# Altium project RTLS_Anchor.PrjPcb
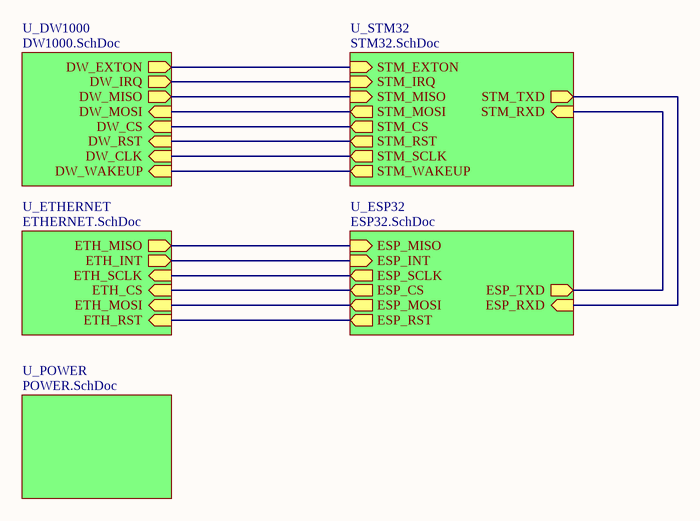
[diagram p0: ANCHOR.SchDoc]
6 sheets, 126 parts. Net scope: hierarchical (ports join the sheet entries above them; power ports are global).
Board files: Anchor_PCB.PcbDoc, AnchorV2.PcbDoc
Sheets:
  ANCHOR.SchDoc
    U_ETHERNET = ETHERNET.SchDoc
    U_POWER = POWER.SchDoc
    U_DW1000 = DW1000.SchDoc
    U_ESP32 = ESP32.SchDoc
    U_STM32 = STM32.SchDoc

## Sheet ANCHOR.SchDoc
size A; SheetNumber: 1; SheetTotal: 6

### Sub-sheets
U_DW1000 = DW1000.SchDoc: DW_MOSI (in), DW_CS (in), DW_EXTON (out), DW_IRQ (out), DW_RST (in), DW_CLK (in), DW_MISO (out), DW_WAKEUP (in)
U_ESP32 = ESP32.SchDoc: ESP_RXD (in), ESP_TXD (out), ESP_MISO (in), ESP_MOSI (out), ESP_SCLK (out), ESP_CS (out), ESP_RST (out), ESP_INT (in)
U_ETHERNET = ETHERNET.SchDoc: ETH_RST (in), ETH_INT (out), ETH_MOSI (in), ETH_MISO (out), ETH_SCLK (in), ETH_CS (in)
U_POWER = POWER.SchDoc: no entries
U_STM32 = STM32.SchDoc: STM_CS (out), STM_SCLK (out), STM_MISO (in), STM_MOSI (out), STM_RST (out), STM_WAKEUP (out), STM_EXTON (in), STM_IRQ (in), STM_RXD (in), STM_TXD (out)

### Nets
DW_NRST: sheet U_DW1000/DW_RST, sheet U_STM32/STM_RST
EHT_RST: sheet U_ETHERNET/ETH_RST, sheet U_ESP32/ESP_RST
ETH_CS: sheet U_ETHERNET/ETH_CS, sheet U_ESP32/ESP_CS
ETH_INT: sheet U_ETHERNET/ETH_INT, sheet U_ESP32/ESP_INT
ETH_MISO: sheet U_ETHERNET/ETH_MISO, sheet U_ESP32/ESP_MISO
ETH_MOSI: sheet U_ETHERNET/ETH_MOSI, sheet U_ESP32/ESP_MOSI
ETH_SCLK: sheet U_ETHERNET/ETH_SCLK, sheet U_ESP32/ESP_SCLK
EXTON: sheet U_DW1000/DW_EXTON, sheet U_STM32/STM_EXTON
IRQ: sheet U_DW1000/DW_IRQ, sheet U_STM32/STM_IRQ
RXD2: sheet U_ESP32/ESP_RXD, sheet U_STM32/STM_TXD
SPI1_CLK: sheet U_DW1000/DW_CLK, sheet U_STM32/STM_SCLK
SPI1_CS: sheet U_DW1000/DW_CS, sheet U_STM32/STM_CS
SPI1_MISO: sheet U_DW1000/DW_MISO, sheet U_STM32/STM_MISO
SPI1_MOSI: sheet U_DW1000/DW_MOSI, sheet U_STM32/STM_MOSI
TXD2: sheet U_ESP32/ESP_TXD, sheet U_STM32/STM_RXD
WAKEUP: sheet U_DW1000/DW_WAKEUP, sheet U_STM32/STM_WAKEUP

## Sheet ETHERNET.SchDoc
size A3; SheetNumber: 5; SheetTotal: 6
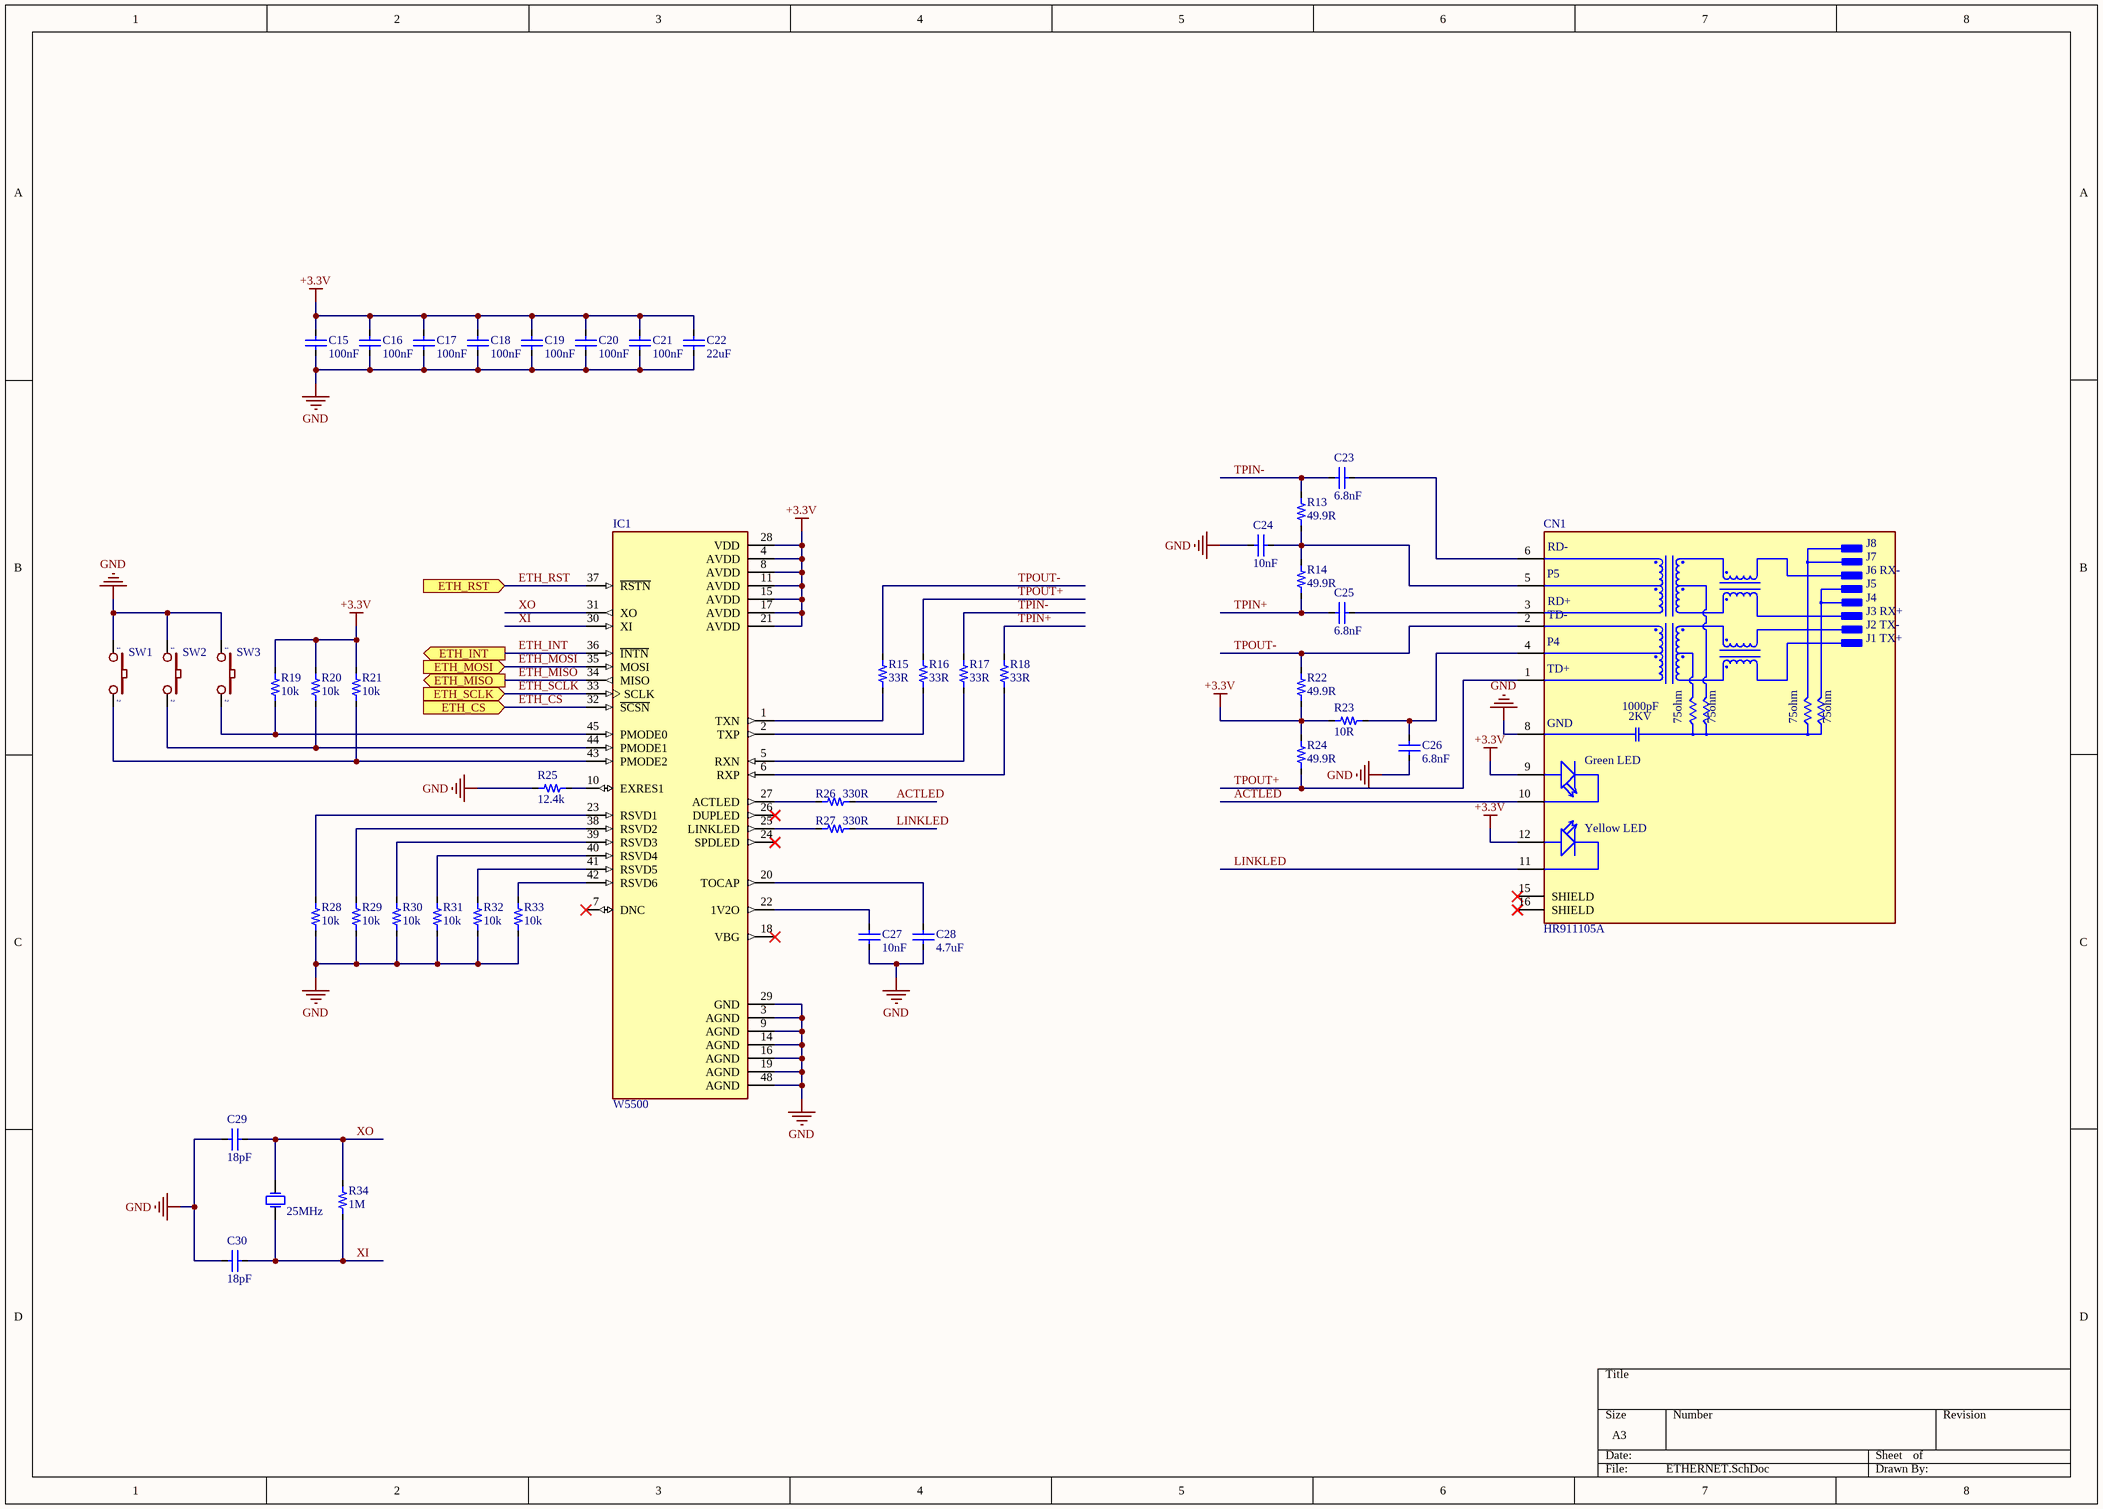
[diagram p1: ETHERNET.SchDoc]

### Parts
C15  100nF  [CAP_0603]
C16  100nF  [CAP_0603]
C17  100nF  [CAP_0603]
C18  100nF  [CAP_0603]
C19  100nF  [CAP_0603]
C20  100nF  [CAP_0603]
C21  100nF  [CAP_0603]
C22  22uF  [CAP_0603]
C23  6.8nF  [CAP_0603]
C24  10nF  [CAP_0603]
C25  6.8nF  [CAP_0603]
C26  6.8nF  [CAP_0603]
C27  10nF  [CAP_0603]
C28  4.7uF  [CAP_0603]
C29  18pF  [CAP_0603]
C30  18pF  [CAP_0603]
CN1  HR911105A  [HR911105A]
IC1  W5500  [W5500]
R13  49.9R  [RES-SMD-0603]
R14  49.9R  [RES-SMD-0603]
R15  33R  [RES-SMD-0603]
R16  33R  [RES-SMD-0603]
R17  33R  [RES-SMD-0603]
R18  33R  [RES-SMD-0603]
R19  10k  [RES-SMD-0603]
R20  10k  [RES-SMD-0603]
R21  10k  [RES-SMD-0603]
R22  49.9R  [RES-SMD-0603]
R23  10R  [RES-SMD-0603]
R24  49.9R  [RES-SMD-0603]
R25  12.4k  [RES-SMD-0603]
R26  330R  [RES-SMD-0603]
R27  330R  [RES-SMD-0603]
R28  10k  [RES-SMD-0603]
R29  10k  [RES-SMD-0603]
R30  10k  [RES-SMD-0603]
R31  10k  [RES-SMD-0603]
R32  10k  [RES-SMD-0603]
R33  10k  [RES-SMD-0603]
R34  1M  [RES-SMD-0603]
SW1  SW  [SW]  (value not drawn)
SW2  SW  [SW]  (value not drawn)
SW3  SW  [SW]  (value not drawn)
Y1  25MHz  [XTAL]

### Ports
ETH_CS (in), ETH_INT (out), ETH_MISO (out), ETH_MOSI (in), ETH_RST (in), ETH_SCLK (in)

### Nets
+3.3V: C15.1 C16.1 C17.1 C18.1 C19.1 C20.1 C21.1 C22.1 CN1.9(GA) CN1.12(YA) IC1.4(AVDD) IC1.8(AVDD) IC1.11(AVDD) IC1.15(AVDD) IC1.17(AVDD) IC1.21(AVDD) IC1.28(VDD) R19.2 R20.2 R21.2 R22.2 R23.1 R24.1
GND: C15.2 C16.2 C17.2 C18.2 C19.2 C20.2 C21.2 C22.2 C24.2 C26.2 C27.1 C28.1 C29.1 C30.1 CN1.8(GND) IC1.3(AGND) IC1.9(AGND) IC1.14(AGND) IC1.16(AGND) IC1.19(AGND) IC1.29(GND) IC1.48(AGND) R25.1 R28.1 R29.1 R30.1 R31.1 R32.1 R33.1 SW1.1 SW2.1 SW3.1
ACTLED: CN1.10(GC) R26.2
ETH_CS: IC1.32(~{SCSN}) ; port ETH_CS
ETH_INT: IC1.36(~{INTN}) ; port ETH_INT
ETH_MISO: IC1.34(MISO) ; port ETH_MISO
ETH_MOSI: IC1.35(MOSI) ; port ETH_MOSI
ETH_RST: IC1.37(~{RSTN}) ; port ETH_RST  [project net EHT_RST]
ETH_SCLK: IC1.33(SCLK) ; port ETH_SCLK
LINKLED: CN1.11(YC) R27.2
TPIN+: C25.2 R14.2 R18.1
TPIN-: C23.2 R13.1 R17.1
TPOUT+: CN1.1(TD+) R16.1 R24.2
TPOUT-: CN1.2(TD-) R15.1 R22.1
XI: C30.2 IC1.30(XI) R34.1 Y1.2(OSC2)
XO: C29.2 IC1.31(XO) R34.2 Y1.1(OSC1)
NetC23_1: C23.1 CN1.6(RD-)
NetC24_1: C24.1 CN1.5(P5) R13.2 R14.1
NetC25_1: C25.1 CN1.3(RD+)
NetC26_1: C26.1 CN1.4(P4) R23.2
NetC27_2: C27.2 IC1.22(1V2O)
NetC28_2: C28.2 IC1.20(TOCAP)
NetIC1_1: IC1.1(TXN) R15.2
NetIC1_2: IC1.2(TXP) R16.2
NetIC1_5: IC1.5(RXN) R17.2
NetIC1_6: IC1.6(RXP) R18.2
NetIC1_10: IC1.10(EXRES1) R25.2
NetIC1_23: IC1.23(RSVD1) R28.2
NetIC1_25: IC1.25(LINKLED) R27.1
NetIC1_27: IC1.27(ACTLED) R26.1
NetIC1_38: IC1.38(RSVD2) R29.2
NetIC1_39: IC1.39(RSVD3) R30.2
NetIC1_40: IC1.40(RSVD4) R31.2
NetIC1_41: IC1.41(RSVD5) R32.2
NetIC1_42: IC1.42(RSVD6) R33.2
NetIC1_43: IC1.43(PMODE2) R21.1 SW1.2
NetIC1_44: IC1.44(PMODE1) R20.1 SW2.2
NetIC1_45: IC1.45(PMODE0) R19.1 SW3.2

Not connected (* = marked no-connect by the designer): CN1 15(SHIELD)* 16(SHIELD)*; IC1 7(DNC)* 18(VBG)* 24(SPDLED)* 26(DUPLED)*

### Notes on the sheet
- (in symbol HR911105A) J8; J7; J6 RX-; J5; J4; J3 RX+; J2 TX-; J1 TX+; 1000pF; 2KV; 75ohm; Green LED; Yellow LED

### Library data of the parts
C15-C30 = CapSMD: Capacitor; Value: 33p; Published: 8-Jun-2000; LatestRevisionDate: 17-Jul-2002; LatestRevisionNote: Re-released for DXP Platform.; PackageReference: RAD-0.3; Publisher: Altium Limited
R13-R34 = Resistor - SMD: Resistor; Manufacturer: Generic Components; Class: Passive; Published: 08/06/2000; Publisher: Altium Hobart Technology Centre
Y1 = XTAL: Crystal Oscillator; Published: 8-Jun-2000; LatestRevisionDate: 17-Jul-2002; LatestRevisionNote: Re-released for DXP Platform.; PackageReference: R38; Publisher: Altium Limited

## Sheet POWER.SchDoc
size A4; SheetNumber: 3; SheetTotal: 6
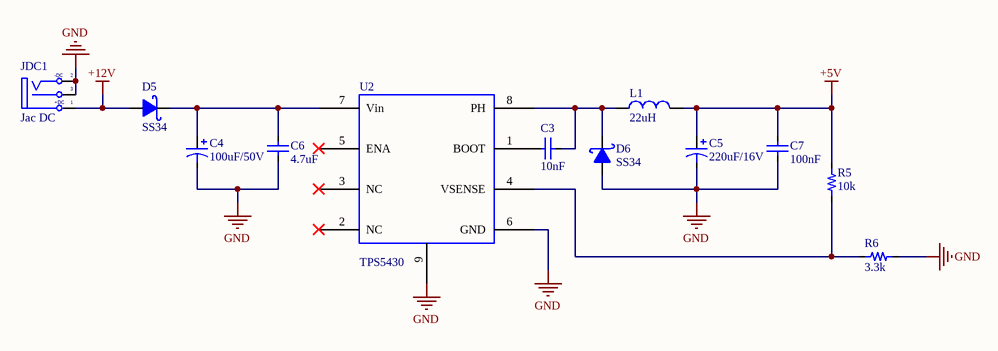
[diagram p2: POWER.SchDoc]

### Parts
C3  10nF  [CAP_0805]
C4  100uF/50V  [C8mm]
C5  220uF/16V  [C5mm]
C6  4.7uF  [CAP_0805]
C7  100nF  [CAP_0805]
D5  SS34  [DIODE SMA]
D6  SS34  [DIODE SMA]
JDC1  Jac DC  [DC-IN]
L1  22uH  [L_SMD]
R5  10k  [RES-SMD-0805]
R6  3.3k  [RES-SMD-0805]
U2  TPS5430  [TPS5430-2]

### Nets
+5V: C5.1 C7.1 L1.2 R5.2
+12V: D5.1(A) JDC1.1(T)
GND: C4.2 C5.2 C6.2 C7.2 D6.1(A) JDC1.2(TN) JDC1.3(S) R6.2 U2.6(GND) U2.9(PWR_PAD)
NetC3_1: C3.1 U2.1(BOOT)
NetC3_2: C3.2 D6.2(K) L1.1 U2.8(PH)
NetC4_1: C4.1 C6.1 D5.2(K) U2.7(Vin)
NetR5_1: R5.1 R6.1 U2.4(VSENSE)

Not connected (* = marked no-connect by the designer): U2 2(NC)* 3(NC)* 5(ENA)*

### Notes on the sheet
- (in symbol DCIN) -DC; +DC

### Library data of the parts
C3 C6 C7 = CapSMD: Capacitor; Value: 33p; Published: 8-Jun-2000; LatestRevisionDate: 17-Jul-2002; LatestRevisionNote: Re-released for DXP Platform.; PackageReference: RAD-0.3; Publisher: Altium Limited
C4 C5 = Cap Pol: Polarized Capacitor (Axial); Published: 8-Jun-2000; LatestRevisionDate: 17-Jul-2002; LatestRevisionNote: Re-released for DXP Platform.; PackageReference: POLAR0.8; Publisher: Altium Limited
D5 D6 = 1N5822: Schottky Rectifiers; Value: Diode c?m 1N5408
JDC1 = DCIN: Jac DC input; Value: Jac DC
L1 = Inductor: CD73R 22uH 1.23A 7345; Value: 150 mH
R5 R6 = Resistor - SMD: as R13 on sheet ETHERNET; Published: 08/06/2000; Publisher: Altium Hobart Technology Centre
U2 = TPS5430: Name: TPS5430

## Sheet DW1000.SchDoc
size A; SheetNumber: 2; SheetTotal: 6
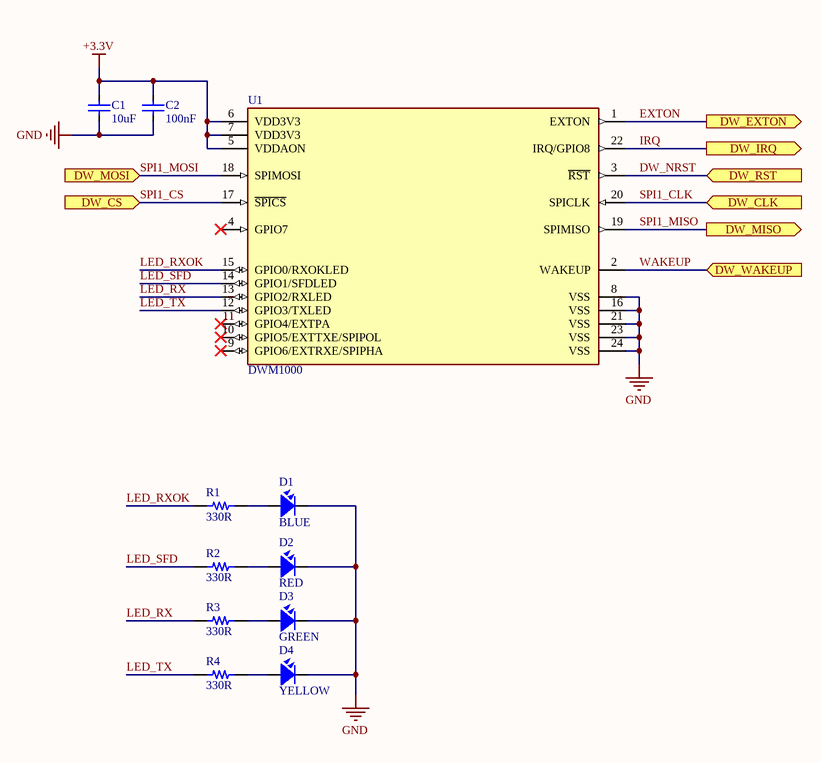
[diagram p3: DW1000.SchDoc]

### Parts
C1  10uF  [CAP_0603]
C2  100nF  [CAP_0603]
D1  BLUE  [LED-0603-Green]
D2  RED  [LED-0603-Red]
D3  GREEN  [LED-0603-Green]
D4  YELLOW  [LED-0603-Green]
R1  330R  [RES-SMD-0603]
R2  330R  [RES-SMD-0603]
R3  330R  [RES-SMD-0603]
R4  330R  [RES-SMD-0603]
U1  DWM1000  [DW1000]

### Ports
DW_CLK (in), DW_CS (in), DW_EXTON (out), DW_IRQ (out), DW_MISO (out), DW_MOSI (in), DW_RST (in), DW_WAKEUP (in)

### Nets
+3.3V: C1.2 C2.2 U1.5(VDDAON) U1.6(VDD3V3) U1.7(VDD3V3)
GND: C1.1 C2.1 D1.2 D2.2 D3.2 D4.2 U1.8(VSS) U1.16(VSS) U1.21(VSS) U1.23(VSS) U1.24(VSS)
DW_NRST: U1.3(~{RST}) ; port DW_RST
EXTON: U1.1(EXTON) ; port DW_EXTON
IRQ: U1.22(IRQ/GPIO8) ; port DW_IRQ
LED_RX: R3.2 U1.13(GPIO2/RXLED)
LED_RXOK: R1.2 U1.15(GPIO0/RXOKLED)
LED_SFD: R2.2 U1.14(GPIO1/SFDLED)
LED_TX: R4.2 U1.12(GPIO3/TXLED)
SPI1_CLK: U1.20(SPICLK) ; port DW_CLK
SPI1_CS: U1.17(~{SPICS}) ; port DW_CS
SPI1_MISO: U1.19(SPIMISO) ; port DW_MISO
SPI1_MOSI: U1.18(SPIMOSI) ; port DW_MOSI
WAKEUP: U1.2(WAKEUP) ; port DW_WAKEUP
NetD1_1: D1.1 R1.1
NetD2_1: D2.1 R2.1
NetD3_1: D3.1 R3.1
NetD4_1: D4.1 R4.1

Not connected (* = marked no-connect by the designer): U1 4(GPIO7)* 9(GPIO6/EXTRXE/SPIPHA)* 10(GPIO5/EXTTXE/SPIPOL)* 11(GPIO4/EXTPA)*

### Library data of the parts
C1 C2 = CapSMD: Capacitor; Value: 33p; Published: 8-Jun-2000; LatestRevisionDate: 17-Jul-2002; LatestRevisionNote: Re-released for DXP Platform.; PackageReference: RAD-0.3; Publisher: Altium Limited
D1-D4 = LED: LED Single colour Green and Red; Value: LED 3 ly Single Colour
R1-R4 = Resistor - SMD: as R13 on sheet ETHERNET; Published: 08/06/2000; Publisher: Altium Hobart Technology Centre
U1 = DWM1000: Decawave's DW1000 Ultra / Wideband (UWB) transceiver IC

## Sheet ESP32.SchDoc
size A; SheetNumber: 4; SheetTotal: 6
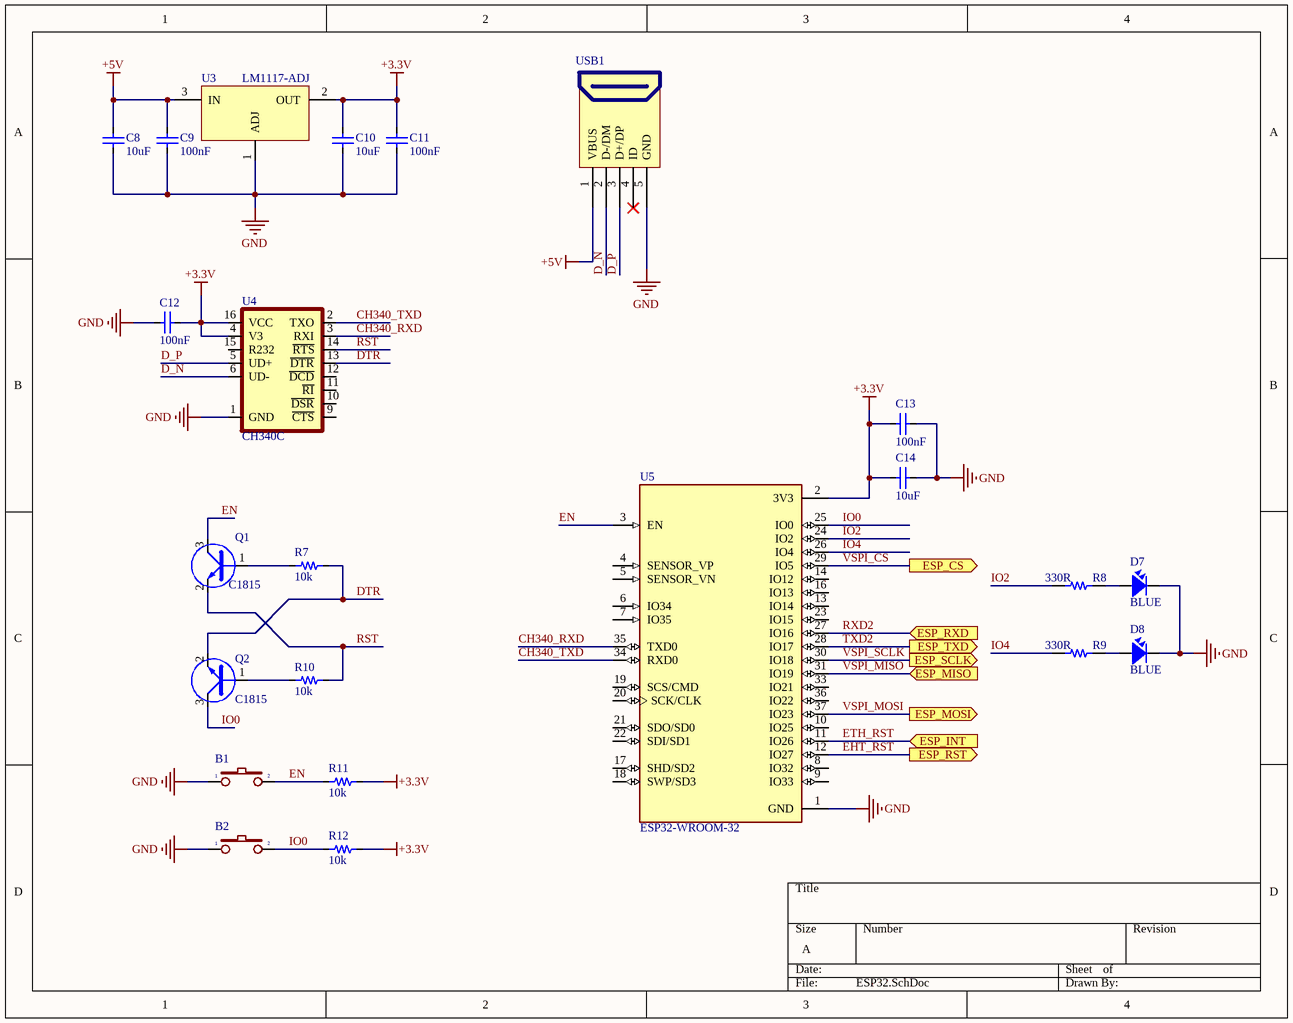
[diagram p4: ESP32.SchDoc]

### Parts
B1  Button 3x4x2.5  [Button 3x4x2.5]  (value not drawn)
B2  Button 3x4x2.5  [BUTTON NGHIENG]  (value not drawn)
C8  10uF  [CAP_0603]
C9  100nF  [CAP_0603]
C10  10uF  [CAP_0603]
C11  100nF  [CAP_0603]
C12  100nF  [CAP_0603]
C13  100nF  [CAP_0603]
C14  10uF  [CAP_0603]
D7  BLUE  [LED-0603-Green]
D8  BLUE  [LED-0603-Green]
Q1  C1815  [SOT23D]
Q2  C1815  [SOT23D]
R7  10k  [RES-SMD-0603]
R8  330R  [RES-SMD-0603]
R9  330R  [RES-SMD-0603]
R10  10k  [RES-SMD-0603]
R11  10k  [RES-SMD-0603]
R12  10k  [RES-SMD-0603]
U3  LM1117-ADJ  [LM1117-SOP]
U4  CH340C  [SO16]
U5  ESP32-WROOM-32  [ESP32_UE]
USB1  USB Micro 5p DIP  [USB Micro 5p DIP]  (value not drawn)

### Ports
ESP_CS (out), ESP_INT (in), ESP_MISO (in), ESP_MOSI (out), ESP_RST (out), ESP_RXD (in), ESP_SCLK (out), ESP_TXD (out)

### Nets
+3.3V: C10.1 C11.1 C12.1 C13.1 C14.1 R11.1 R12.1 U3.2(OUT) U4.4(V3) U4.16(VCC) U5.2(3V3)
+5V: C8.1 C9.1 U3.3(IN) USB1.1(VBUS)
GND: B1.1 B2.1 C8.2 C9.2 C10.2 C11.2 C12.2 C13.2 C14.2 D7.2 D8.2 U3.1(ADJ) U4.1(GND) U5.1(GND) USB1.5(GND)
CH340_RXD: U4.3(RXI) U5.35(TXD0)
CH340_TXD: U4.2(TXO) U5.34(RXD0)
D_N: U4.6(UD-) USB1.2(D-/DM)
D_P: U4.5(UD+) USB1.3(D+/DP)
DTR: Q2.2(E) R7.1 U4.13(~{DTR})
EHT_RST: U5.12(IO27) ; port ESP_RST
EN: B1.2 Q1.3(C) R11.2 U5.3(EN)
ETH_RST: U5.11(IO26) ; port ESP_INT  [project net ETH_INT]
IO0: B2.2 Q2.3(C) R12.2 U5.25(IO0)
IO2: R8.2 U5.24(IO2)
IO4: R9.2 U5.26(IO4)
RST: Q1.2(E) R10.1 U4.14(~{RTS})
RXD2: U5.27(IO16) ; port ESP_RXD
TXD2: U5.28(IO17) ; port ESP_TXD
VSPI_CS: U5.29(IO5) ; port ESP_CS  [project net ETH_CS]
VSPI_MISO: U5.31(IO19) ; port ESP_MISO  [project net ETH_MISO]
VSPI_MOSI: U5.37(IO23) ; port ESP_MOSI  [project net ETH_MOSI]
VSPI_SCLK: U5.30(IO18) ; port ESP_SCLK  [project net ETH_SCLK]
NetD7_1: D7.1 R8.1
NetD8_1: D8.1 R9.1
NetQ1_1: Q1.1(B) R7.2
NetQ2_1: Q2.1(B) R10.2

Not connected (* = marked no-connect by the designer): U4 9(~{CTS}) 10(~{DSR}) 11(~{RI}) 12(~{DCD}) 15(R232); U5 4(SENSOR_VP) 5(SENSOR_VN) 6(IO34) 7(IO35) 8(IO32) 9(IO33) 10(IO25) 13(IO14) 14(IO12) 16(IO13) 17(SHD/SD2) 18(SWP/SD3) 19(SCS/CMD) 20(SCK/CLK) 21(SDO/SD0) 22(SDI/SD1) 23(IO15) 33(IO21) 36(IO22); USB1 4(ID)*

### Library data of the parts
C8-C14 = CapSMD: Capacitor; Value: 33p; Published: 8-Jun-2000; LatestRevisionDate: 17-Jul-2002; LatestRevisionNote: Re-released for DXP Platform.; PackageReference: RAD-0.3; Publisher: Altium Limited
D7 D8 = LED: as D1 on sheet DW1000
Q1 Q2 = 2SC1815: NPN 600mW, ECB; Value: C1815
R7-R12 = Resistor - SMD: as R13 on sheet ETHERNET; Published: 08/06/2000; Publisher: Altium Hobart Technology Centre
U3 = LM1117-ADJ: 800mA Low-Dropout Linear Regulator; Creator: Nguyen Ba Bien; Website: http://group3i.net
U4 = CH340C: USB to serial chip CH340; MF: WCH; Package: Package; Check_prices: https://www.snapeda.com/parts/CH340C/WCH/view-part/5428851/?ref=eda; Value: *; Price: None; MP: CH340C; Availability: Unavailable; SnapEDA_Link: https://www.snapeda.com/parts/CH340C/WCH/view-part/5428851/?ref=snap
U5 = ESP32-WROOM-32: Bluetooth, WiFi Transceiver Module 2.4GHz ~ 2.5GHz Surface Mount; MF: Espressif Systems; Package: Module Espressif Systems; Digi-Key_Part_Number: 1904-1010-1-ND; Digi-Key_Purchase_URL: https://www.digikey.com/product-detail/en/espressif-systems/ESP32-WROOM-32/1904-1010-1-ND/8544305?utm_source=snapeda&utm_medium=aggregator&utm_campaign=symbol; Value: *; MP: ESP32-WROOM-32; SnapEDA_Link: https://www.snapeda.com/parts/ESP32-WROOM-32/Espressif%20Systems/view-part/2753322/?ref=snap
USB1 = USB Micro 5p DIP: USB Type B; Ten: MicroUSB MK5P DIP; Ma_Hang: MH005145

## Sheet STM32.SchDoc
size A3; SheetNumber: 6; SheetTotal: 6
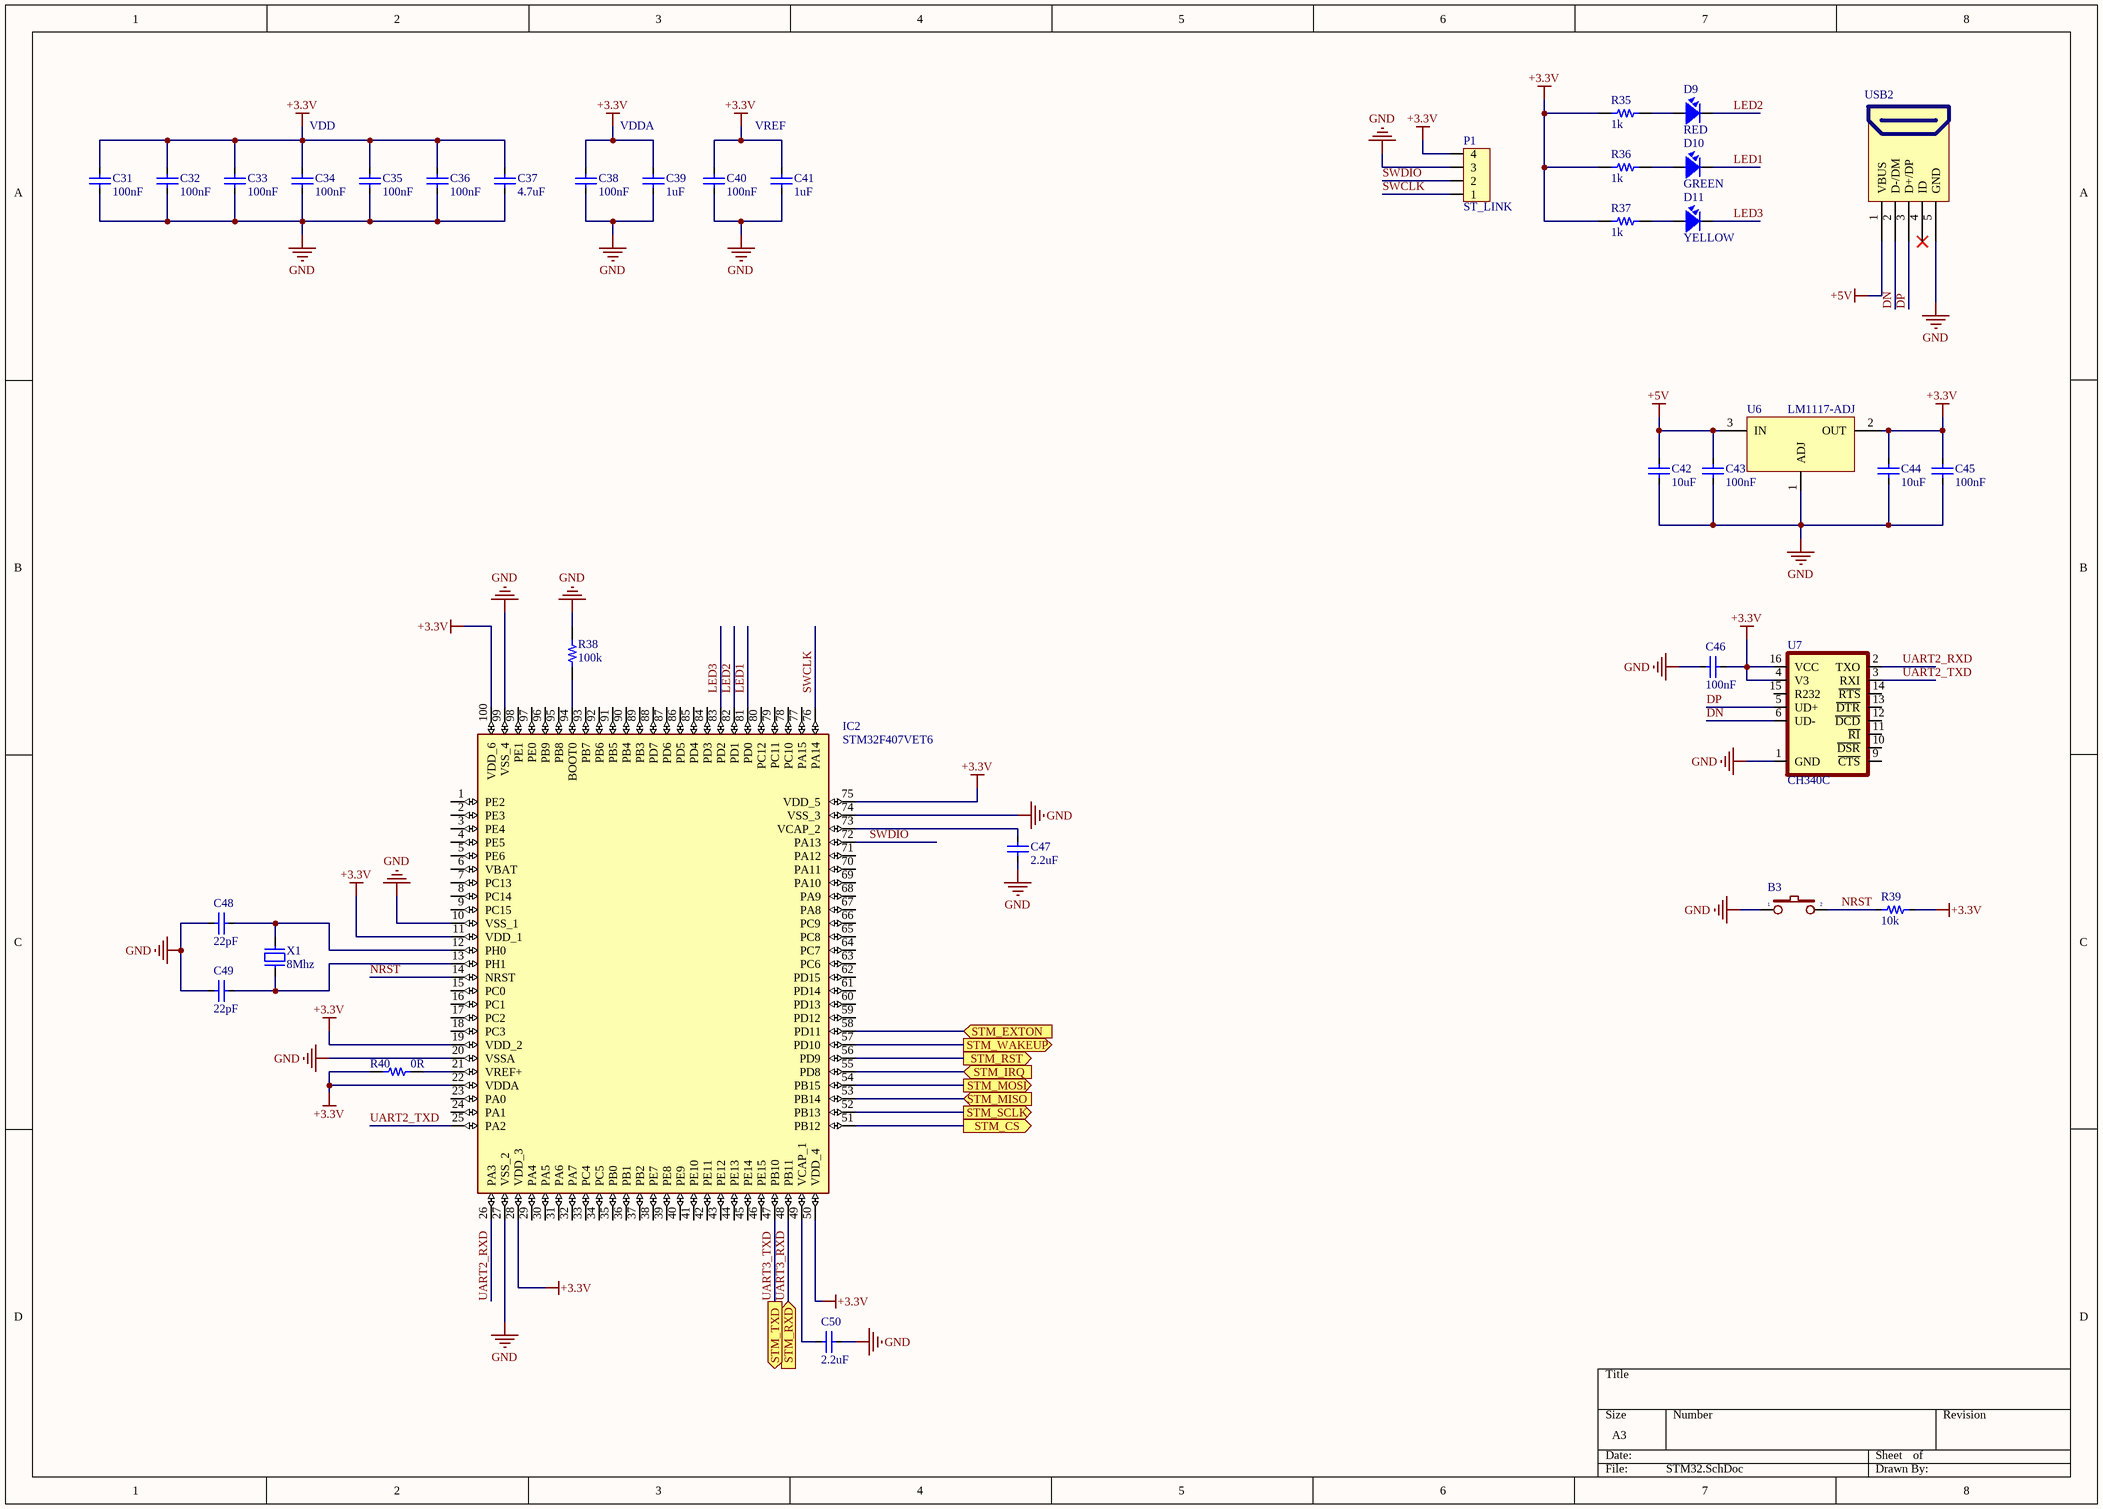
[diagram p5: STM32.SchDoc]

### Parts
B3  Button 3x4x2.5  [Button 3x4x2.5]  (value not drawn)
C31  100nF  [CAP_0603]
C32  100nF  [CAP_0603]
C33  100nF  [CAP_0603]
C34  100nF  [CAP_0603]
C35  100nF  [CAP_0603]
C36  100nF  [CAP_0603]
C37  4.7uF  [CAP_0603]
C38  100nF  [CAP_0603]
C39  1uF  [CAP_0603]
C40  100nF  [CAP_0603]
C41  1uF  [CAP_0603]
C42  10uF  [CAP_0603]
C43  100nF  [CAP_0603]
C44  10uF  [CAP_0603]
C45  100nF  [CAP_0603]
C46  100nF  [CAP_0603]
C47  2.2uF  [CAP_0603]
C48  22pF  [CAP_0603]
C49  22pF  [CAP_0603]
C50  2.2uF  [CAP_0603]
D9  RED  [LED-0603-Red]
D10  GREEN  [LED-0603-Green]
D11  YELLOW  [LED-0603-Red]
IC2  STM32F407VET6  [STM32F407VET6]
P1  ST_LINK  [HEADER4P-1.25]
R35  1k  [RES-SMD-0603]
R36  1k  [RES-SMD-0603]
R37  1k  [RES-SMD-0603]
R38  100k  [RES-SMD-0603]
R39  10k  [RES-SMD-0603]
R40  0R  [RES-SMD-0603]
U6  LM1117-ADJ  [LM1117-SOP]
U7  CH340C  [SO16]
USB2  USB Micro 5p DIP  [USB Micro 5p DIP]  (value not drawn)
X1  8Mhz  [XTAL 5032 SMD]

### Ports
STM_CS (out), STM_EXTON (in), STM_IRQ (in), STM_MISO (in), STM_MOSI (out), STM_RST (out), STM_RXD (in), STM_SCLK (out), STM_TXD (out), STM_WAKEUP (out)

### Nets
+3.3V: C31.2 C32.2 C33.2 C34.2 C35.2 C36.2 C37.2 C38.2 C39.2 C40.2 C41.2 C44.1 C45.1 C46.1 IC2.11(VDD_1) IC2.19(VDD_2) IC2.22(VDDA) IC2.28(VDD_3) IC2.50(VDD_4) IC2.75(VDD_5) IC2.100(VDD_6) P1.4 R35.2 R36.2 R37.2 R39.1 R40.2 U6.2(OUT) U7.4(V3) U7.16(VCC)
+5V: C42.1 C43.1 U6.3(IN) USB2.1(VBUS)
GND: B3.1 C31.1 C32.1 C33.1 C34.1 C35.1 C36.1 C37.1 C38.1 C39.1 C40.1 C41.1 C42.2 C43.2 C44.2 C45.2 C46.2 C47.2 C48.1 C49.1 C50.2 IC2.10(VSS_1) IC2.20(VSSA) IC2.27(VSS_2) IC2.74(VSS_3) IC2.99(VSS_4) P1.3 R38.1 U6.1(ADJ) U7.1(GND) USB2.5(GND)
DN: U7.6(UD-) USB2.2(D-/DM)
DP: U7.5(UD+) USB2.3(D+/DP)
DW_NRST: IC2.56(PD9) ; port STM_RST
EXTON: IC2.58(PD11) ; port STM_EXTON
IRQ: IC2.55(PD8) ; port STM_IRQ
LED1: D10.2 IC2.81(PD0)
LED2: D9.2 IC2.82(PD1)
LED3: D11.2 IC2.83(PD2)
NRST: B3.2 IC2.14(NRST) R39.2
SPI1_CLK: IC2.52(PB13) ; port STM_SCLK
SPI1_CS: IC2.51(PB12) ; port STM_CS
SPI1_MISO: IC2.53(PB14) ; port STM_MISO
SPI1_MOSI: IC2.54(PB15) ; port STM_MOSI
SWCLK: IC2.76(PA14) P1.1
SWDIO: IC2.72(PA13) P1.2
UART2_RXD: IC2.26(PA3) U7.2(TXO)
UART2_TXD: IC2.25(PA2) U7.3(RXI)
UART3_RXD: IC2.48(PB11) ; port STM_RXD  [project net TXD2]
UART3_TXD: IC2.47(PB10) ; port STM_TXD  [project net RXD2]
WAKEUP: IC2.57(PD10) ; port STM_WAKEUP
NetC47_1: C47.1 IC2.73(VCAP_2)
NetC48_2: C48.2 IC2.12(PH0) X1.1
NetC49_2: C49.2 IC2.13(PH1) X1.2
NetC50_1: C50.1 IC2.49(VCAP_1)
NetD9_1: D9.1 R35.1
NetD10_1: D10.1 R36.1
NetD11_1: D11.1 R37.1
NetIC2_21: IC2.21(VREF+) R40.1
NetIC2_94: IC2.94(BOOT0) R38.2

Not connected (* = marked no-connect by the designer): IC2 1(PE2) 2(PE3) 3(PE4) 4(PE5) 5(PE6) 6(VBAT) 7(PC13) 8(PC14) 9(PC15) 15(PC0) 16(PC1) 17(PC2) 18(PC3) 23(PA0) 24(PA1) 29(PA4) 30(PA5) 31(PA6) 32(PA7) 33(PC4) 34(PC5) 35(PB0) 36(PB1) 37(PB2) 38(PE7) 39(PE8) 40(PE9) 41(PE10) 42(PE11) 43(PE12) 44(PE13) 45(PE14) 46(PE15) 59(PD12) 60(PD13) 61(PD14) 62(PD15) 63(PC6) 64(PC7) 65(PC8) 66(PC9) 67(PA8) 68(PA9) 69(PA10) 70(PA11) 71(PA12) 77(PA15) 78(PC10) 79(PC11) 80(PC12) 84(PD3) 85(PD4) 86(PD5) 87(PD6) 88(PD7) 89(PB3) 90(PB4) 91(PB5) 92(PB6) 93(PB7) 95(PB8) 96(PB9) 97(PE0) 98(PE1); U7 9(~{CTS}) 10(~{DSR}) 11(~{RI}) 12(~{DCD}) 13(~{DTR}) 14(~{RTS}) 15(R232); USB2 4(ID)*

### Notes on the sheet
- VDD
- VDDA
- VREF

### Library data of the parts
C31-C50 = CapSMD: Capacitor; Value: 33p; Published: 8-Jun-2000; LatestRevisionDate: 17-Jul-2002; LatestRevisionNote: Re-released for DXP Platform.; PackageReference: RAD-0.3; Publisher: Altium Limited
D9-D11 = LED: as D1 on sheet DW1000
P1 = Header4: Header IDC, 4 x 1 Pin Vertical 2.54mm Pitch (Non-Boxed, Male); Manufacturer: W¨¹rth Elektronik eiSos GmbH; partNo: 613002143121; ComponentLink1 Description: Manufacturer; ComponentLink2 Description: Datasheet; NoPins: 02; Created Date: 29 March 2013; ComponentLink1URL: http://www.we-online.com; ComponentLink2URL: http://katalog.we-online.de/em/datasheet/6130xx143121.pdf; Created by: Karrer Zheng
R35-R40 = Resistor - SMD: as R13 on sheet ETHERNET; Published: 08/06/2000; Publisher: Altium Hobart Technology Centre
U6 = LM1117-ADJ: 800mA Low-Dropout Linear Regulator; Creator: Nguyen Ba Bien; Website: http://group3i.net
U7 = CH340C: USB to serial chip CH340; MF: WCH; Package: Package; Check_prices: https://www.snapeda.com/parts/CH340C/WCH/view-part/5428851/?ref=eda; Value: *; Price: None; MP: CH340C; Availability: Unavailable; SnapEDA_Link: https://www.snapeda.com/parts/CH340C/WCH/view-part/5428851/?ref=snap
USB2 = USB Micro 5p DIP: as USB1 on sheet ESP32
X1 = XT2: Crystal For all Crystal 2pin.; Value: 4Mhz

## Nets that join several sheets
+3.3V: ETHERNET (23 pins), DW1000 (5 pins), ESP32 (11 pins), STM32 (30 pins)
+5V: POWER (C5.1 C7.1 L1.2 R5.2), ESP32 (C8.1 C9.1 U3.3 USB1.1), STM32 (C42.1 C43.1 U6.3 USB2.1)
GND: ETHERNET (32 pins), POWER (10 pins), DW1000 (11 pins), ESP32 (15 pins), STM32 (31 pins)
DW_NRST: DW1000 (U1.3), STM32 (IC2.56)
EHT_RST: ETHERNET (IC1.37), ESP32 (U5.12)
ETH_CS: ETHERNET (IC1.32), ESP32 (U5.29)
ETH_INT: ETHERNET (IC1.36), ESP32 (U5.11)
ETH_MISO: ETHERNET (IC1.34), ESP32 (U5.31)
ETH_MOSI: ETHERNET (IC1.35), ESP32 (U5.37)
ETH_SCLK: ETHERNET (IC1.33), ESP32 (U5.30)
EXTON: DW1000 (U1.1), STM32 (IC2.58)
IRQ: DW1000 (U1.22), STM32 (IC2.55)
RXD2: ESP32 (U5.27), STM32 (IC2.47)
SPI1_CLK: DW1000 (U1.20), STM32 (IC2.52)
SPI1_CS: DW1000 (U1.17), STM32 (IC2.51)
SPI1_MISO: DW1000 (U1.19), STM32 (IC2.53)
SPI1_MOSI: DW1000 (U1.18), STM32 (IC2.54)
TXD2: ESP32 (U5.28), STM32 (IC2.48)
WAKEUP: DW1000 (U1.2), STM32 (IC2.57)